# Altium project IoT-Speaker-v1.3.PrjPcb (part 2 of 2)

## Sheet Power-Sheet-2.SchDoc
size A4; DocumentNumber: 3; SheetNumber: 3; SheetTotal: 5
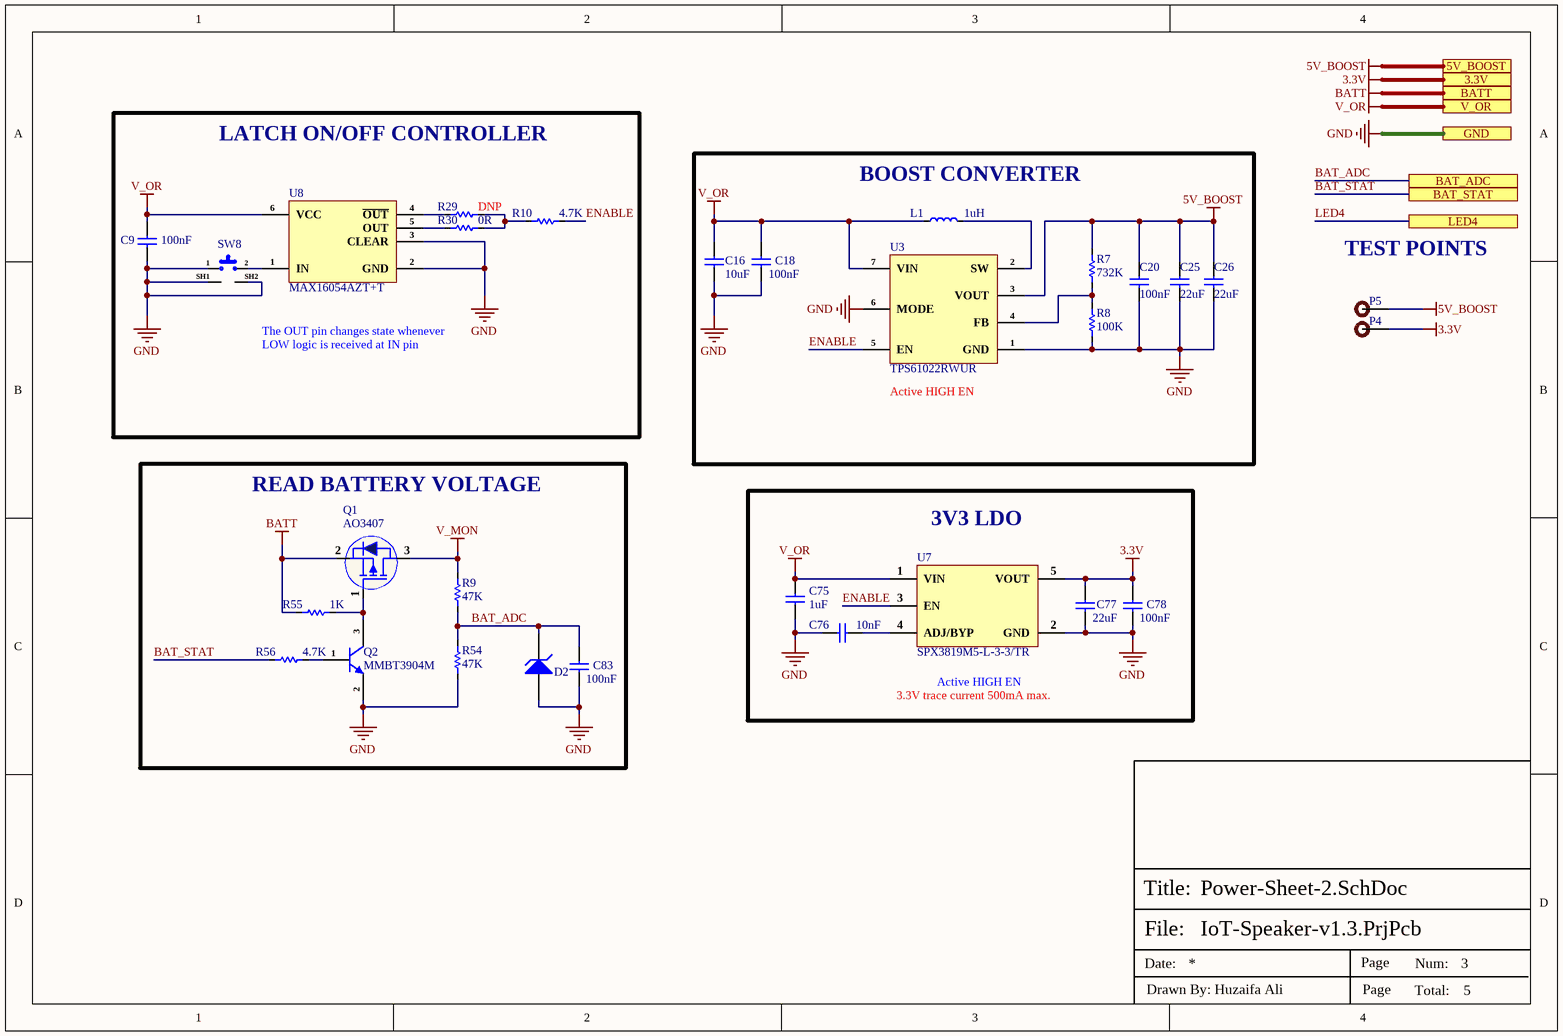
[diagram p1: Power-Sheet-2.SchDoc]

### Parts
C9  100nF  [Cap-0402]
C16  10uF  [Cap-0805]
C18  100nF  [Cap-0402]
C20  100nF  [Cap-0402]
C25  22uF  [Cap-0603]
C26  22uF  [Cap-0603]
C75  1uF  [Cap-0603]
C76  10nF  [Cap-0603]
C77  22uF  [Cap-0603]
C78  100nF  [Cap-0402]
C83  100nF  [Cap-0402]
D2  MM3Z3V3B  [SOD323F]  (value not drawn)
L1  1uH  [MPIT6045-1R0N-LF]
P4  TEST POINT  [Test-point]  (value not drawn)
P5  TEST POINT  [Test-point]  (value not drawn)
Q1  AO3407  [SOT-23]
Q2  MMBT3904M  [SOT-723]
R7  732K  [Res-0402]
R8  100K  [Res-0603]
R9  47K  [Res-0603]
R10  4.7K  [Res-0603]
R29  DNP  [Res-0603]  (no BOM)
R30  0R  [Res-0603]
R54  47K  [Res-0603]
R55  1K  [Res-0603]
R56  4.7K  [Res-0603]
SW8  TS-1087E-B3D2  [TS-1087E-B3D2]  (value not drawn)
U3  TPS61022RWUR  [7-VQFN-HR (2x2)]
U7  SPX3819M5-L-3-3/TR  [SOT-23-5]
U8  MAX16054AZT+T  [TSOT-23-6]

### Blocks framed on the sheet
LATCH ON/OFF CONTROLLER: C9 R10 R29 R30 SW8 U8
BOOST CONVERTER: C16 C18 C20 C25 C26 L1 R7 R8 U3
READ BATTERY VOLTAGE: C83 D2 Q1 Q2 R9 R54-R56
3V3 LDO: C75-C78 U7

### Ports
3.3V, 5V_BOOST, BAT_ADC, BAT_STAT, BATT, GND, LED4, V_OR

### Nets
3.3V: C77.2 C78.2 P4.1 U7.5(VOUT) ; port 3.3V
5V_BOOST: C20.2 C25.2 C26.2 P5.1 R7.2 U3.3(VOUT) ; port 5V_BOOST
BATT: Q1.2(S) R55.1 ; port BATT
GND: C9.1 C16.1 C18.1 C20.1 C25.1 C26.1 C75.1 C76.1 C77.1 C78.1 C83.1 D2.1(A) Q2.2(E) R8.1 R54.1 SW8.1 SW8.SH1 SW8.SH2 U3.1(GND) U3.6(MODE) U7.2(GND) U8.2(GND) U8.3(CLEAR) ; port GND
V_MON: Q1.3(D) R9.2
V_OR: C9.2 C16.2 C18.2 C75.2 L1.1 U3.7(VIN) U7.1(VIN) U8.6(VCC) ; port V_OR
BAT_ADC: C83.2 D2.2(K) R9.1 R54.2 ; port BAT_ADC
BAT_STAT: R56.1 ; port BAT_STAT
ENABLE: R10.2 U3.5(EN) U7.3(EN)
LED4: port LED4
NetC76_2: C76.2 U7.4(ADJ/BYP)
NetL1_2: L1.2 U3.2(SW)
NetQ1_1: Q1.1(G) Q2.3(C) R55.2
NetQ2_1: Q2.1(B) R56.2
NetR7_1: R7.1 R8.2 U3.4(FB)
NetR10_1: R10.1 R29.2 R30.2
NetR29_1: R29.1 U8.4(~{OUT})
NetR30_1: R30.1 U8.5(OUT)
NetSW8_2: SW8.2 U8.1(IN)

### Notes on the sheet
- TEST POINTS
- The OUT pin changes state whenever LOW logic is received at IN pin
- (near U3) Active HIGH EN
- 3.3V trace current 500mA max.
- (near U7) Active HIGH EN
- File:
- Title:
- Date:
- Page
- Num:
- Total:
- Drawn By: Huzaifa Ali

### Library data of the parts
C9 C18 C20 C78 C83 = CC0402KRX5R8BB104: CAP CER 0.1UF 25V X5R 0402; Manufacturer: Yageo; Tolerance: 10%; Item Type: Capacitor; Supplier 1: Digi-Key; Manufacturer Part Number: CC0402KRX5R8BB104; RoHS: Yes; Category: Ceramic Capacitors; Stock 1: 4598218; Pricing 1: 1=0.10000, 10=0.03800, 50=0.02100, 100=0.01710, 500=0.01224, 1000=0.00961, 2500=0.00874, 5000=0.00804 (USD); Mount: Surface Mount; Case/Package: 0402; Case Code (Metric): 1005; Case Code (Imperial): 0402; Min Operating Temperature: -55°C; Max Operating Temperature: 85°C; Voltage Rating: 25V; Packaging: Tape and Reel; Capacitance: 100nF; Voltage Rating (DC): 25V; Dielectric: X5R; Resistor Type: Ceramic; Series: CC; Length: 0.039inch; Width: 0.02inch; Thickness: 0.022inch; Depth: 0.5mm; Lead Free: Lead Free; Halogen Free: Halogen Free; RoHS Compliant: Yes; ComponentLink1URL: http://www.mouser.com/ds/2/447/UPY-GPHC_X5R_4V-to-50V_25-1131599.pdf?src-supplier=Mouser; ComponentLink1Description: http://www.mouser.com/ds/2/447/UPY-GPHC_X5R_4V-to-50V_25-1131599.pdf?src-supplier=Mouser; ComponentLink2URL: http://www.yageo.com/documents/recent/UPY-GPHC_X5R_4V-to-50V-16.pdf?src-supplier=Future+Electronics; ComponentLink2Description: http://www.yageo.com/documents/recent/UPY-GPHC_X5R_4V-to-50V-16.pdf?src-supplier=Future+Electronics; ComponentLink3URL: http://www.yageo.com/documents/recent/UPY-GPHC_X5R_4V-to-50V_25.pdf?src-supplier=Digi-Key; ComponentLink3Description: http://www.yageo.com/documents/recent/UPY-GPHC_X5R_4V-to-50V_25.pdf?src-supplier=Digi-Key; Supplier Part Number 1: 311-1697-1-ND; LCSC Part Number: C106256
C16 = CC0805KKX5R8BB106: CAP CER 10UF 25V X5R 0805; Manufacturer: Yageo; Tolerance: 10%; Item Type: Capacitor; Supplier 1: Digi-Key; Manufacturer Part Number: CC0805KKX5R8BB106; RoHS: Yes; Category: Ceramic Capacitors; Stock 1: 554290; Pricing 1: 1=0.31000, 10=0.21200, 50=0.14820, 100=0.12710, 500=0.09534, 1000=0.08050 (USD); Mount: Surface Mount; Case/Package: 0805; Case Code (Imperial): 0805; Case Code (Metric): 2012; Weight: 0.000194oz; Min Operating Temperature: -55°C; Max Operating Temperature: 85°C; Capacitance: 10uF; Voltage Rating (DC): 25V; Packaging: Tape and Reel; Voltage Rating: 25V; Dielectric: X5R; Termination: SMD/SMT; Resistor Type: Ceramic; Series: CC; Length: 0.079inch; Width: 0.049inch; Thickness: 0.057inch; Depth: 1.25mm; Lead Free: Lead Free; Halogen Free: Halogen Free; RoHS Compliant: Yes; ComponentLink1URL: http://www.mouser.com/ds/2/447/UPY-GPHC_X5R_4V-to-50V_25-1131599.pdf?src-supplier=Mouser; ComponentLink1Description: http://www.mouser.com/ds/2/447/UPY-GPHC_X5R_4V-to-50V_25-1131599.pdf?src-supplier=Mouser; ComponentLink2URL: http://www.yageo.com/documents/recent/UPY-GPHC_X5R_4V-to-50V_25.pdf?src-supplier=Digi-Key; ComponentLink2Description: http://www.yageo.com/documents/recent/UPY-GPHC_X5R_4V-to-50V_25.pdf?src-supplier=Digi-Key; Supplier Part Number 1: 311-1869-1-ND; LCSC Part Number: C89831
C25 C26 = CC0603MRX5R6BB226: CAP CER 22UF 10V X5R 0603; Manufacturer: Yageo; Tolerance: 20%; Item Type: Capacitor; Supplier 1: Digi-Key; Manufacturer Part Number: CC0603MRX5R6BB226; RoHS: Yes; Category: Ceramic Capacitors; Stock 1: 19628; Pricing 1: 1=0.68000, 10=0.48000, 50=0.36300, 100=0.31610, 500=0.23416, 1000=0.19903 (USD); Mount: Surface Mount; Case/Package: 0603; Case Code (Metric): 1608; Case Code (Imperial): 0603; Weight: 7.1E-05oz; Min Operating Temperature: -55°C; Max Operating Temperature: 85°C; Packaging: Tape and Reel; Capacitance: 22uF; Voltage Rating: 10V; Dielectric: X5R; Termination: SMD/SMT; Voltage Rating (DC): 10V; Package Quantity: 4000; Length: 0.063inch; Width: 0.8mm; Height: 0.8mm; Thickness: 0.035inch; Lead Free: Lead Free; Halogen Free: Halogen Free; RoHS Compliant: Yes; ComponentLink1URL: http://www.mouser.com/ds/2/447/Yageo_UPY-GP_NP0_16V-to-50V_9-358835.pdf?src-supplier=Mouser; ComponentLink1Description: http://www.mouser.com/ds/2/447/Yageo_UPY-GP_NP0_16V-to-50V_9-358835.pdf?src-supplier=Mouser; ComponentLink2URL: http://www.yageo.com/documents/recent/UPY-GPHC_X5R_4V-to-50V_25.pdf?src-supplier=Digi-Key; ComponentLink2Description: http://www.yageo.com/documents/recent/UPY-GPHC_X5R_4V-to-50V_25.pdf?src-supplier=Digi-Key; Supplier Part Number 1: 311-1819-1-ND; LCSC Part Number: C109447
C75 = CC0603KRX5R8BB105: CAP CER 1UF 25V X5R 0603; Manufacturer: Yageo; Tolerance: 10%; Item Type: Capacitor; Supplier 1: Digi-Key; Manufacturer Part Number: CC0603KRX5R8BB105; RoHS: Yes; Category: Ceramic Capacitors; Stock 1: 919939; Pricing 1: 1=0.12000, 10=0.08400, 50=0.04760, 100=0.03940, 500=0.02764, 1000=0.02288 (USD); Mount: Surface Mount; Case/Package: 0603; Number of Pins: 2; Case Code (Metric): 1608; Case Code (Imperial): 0603; Min Operating Temperature: -55°C; Max Operating Temperature: 85°C; Capacitance: 1uF; Dielectric: X5R; Package Quantity: 1; Voltage Rating: 25V; Packaging: Tape and Reel; Termination: SMD/SMT; Voltage Rating (DC): 25V; Series: CC; Construction: Flat; Length: 1.6mm; Width: 0.031inch; Height: 0.8mm; Thickness: 0.035inch; Depth: 0.8mm; Radiation Hardening: No; REACH SVHC: No SVHC; Lead Free: Lead Free; Halogen Free: Halogen Free; RoHS Compliant: Yes; ComponentLink1URL: https://datasheet.ciiva.com/176/mlccorderingcode-176785.pdf?src-supplier=Digi-Key; ComponentLink1Description: https://datasheet.ciiva.com/176/mlccorderingcode-176785.pdf?src-supplier=Digi-Key; ComponentLink2URL: https://datasheet.ciiva.com/176/mlccorderingcode-176786.pdf?src-supplier=Digi-Key; ComponentLink2Description: https://datasheet.ciiva.com/176/mlccorderingcode-176786.pdf?src-supplier=Digi-Key; ComponentLink3URL: https://datasheet.ciiva.com/176/mlccorderingcode-176787.pdf?src-supplier=Digi-Key; ComponentLink3Description: https://datasheet.ciiva.com/176/mlccorderingcode-176787.pdf?src-supplier=Digi-Key; ComponentLink4URL: https://datasheet.ciiva.com/17436/upy-gphc-x5r-4v-to-50v-12-17436952.pdf?src-supplier=Avnet+Europe; ComponentLink4Description: https://datasheet.ciiva.com/17436/upy-gphc-x5r-4v-to-50v-12-17436952.pdf?src-supplier=Avnet+Europe; ComponentLink5URL: https://datasheet.ciiva.com/7978/1525783-7978171.pdf?src-supplier=Element14; ComponentLink5Description: https://datasheet.ciiva.com/7978/1525783-7978171.pdf?src-supplier=Element14; ComponentLink6URL: https://datasheet.ciiva.com/11586/upy-gphc-x5r-4v-to-50v-12-11586318.pdf?src-supplier=Avnet; ComponentLink6Description: https://datasheet.ciiva.com/11586/upy-gphc-x5r-4v-to-50v-12-11586318.pdf?src-supplier=Avnet; Supplier Part Number 1: 311-1445-1-ND; LCSC Part Number: C14664
C76 = CC0603JRNPO9BN103: CAP CER 10000PF 50V C0G/NPO 0603; Manufacturer: Yageo; Tolerance: 5%; Item Type: Capacitor; Supplier 1: Arrow Electronics; Manufacturer Part Number: CC0603JRNPO9BN103; RoHS: Yes; Category: Ceramic Capacitors; Stock 1: 5425; Pricing 1: 1=0.42340, 10=0.29770, 25=0.25590, 100=0.19550, 250=0.19360, 500=0.14320, 1000=0.12060, 3000=0.11930 (USD); Mount: Surface Mount; Case/Package: 0603; Min Operating Temperature: -55°C; Max Operating Temperature: 125°C; Packaging: Tape and Reel; Capacitance: 10nF; Voltage Rating: 50V; Length: 0.063inch; Width: 0.031inch; Thickness: 0.035inch; RoHS Compliant: Yes; ComponentLink1URL: http://www.yageo.com/documents/recent/UPY-GP_NP0_16V-to-50V_16.pdf?src-supplier=Digi-Key; ComponentLink1Description: http://www.yageo.com/documents/recent/UPY-GP_NP0_16V-to-50V_16.pdf?src-supplier=Digi-Key; ComponentLink2URL: http://www.yageo.com/exep/pages/download/literatures/ProductSelectionGuide%202014_Final_2.pdf?src-supplier=Digi-Key; ComponentLink2Description: http://www.yageo.com/exep/pages/download/literatures/ProductSelectionGuide%202014_Final_2.pdf?src-supplier=Digi-Key; Supplier Part Number 1: CC0603JRNPO9BN103; LCSC Part Number: C389113
C77 = CC0603MRX5R6BB226: CAP CER 22UF 10V X5R 0603; Manufacturer: Yageo; Tolerance: 20%; Supplier 1: Digi-Key; Manufacturer Part Number: CC0603MRX5R6BB226; RoHS: Yes; Category: Ceramic Capacitors; Stock 1: 19628; Pricing 1: 1=0.68000, 10=0.48000, 50=0.36300, 100=0.31610, 500=0.23416, 1000=0.19903 (USD); Mount: Surface Mount; Case/Package: 0603; Case Code (Metric): 1608; Case Code (Imperial): 0603; Weight: 7.1E-05oz; Min Operating Temperature: -55°C; Max Operating Temperature: 85°C; Packaging: Tape and Reel; Capacitance: 22uF; Voltage Rating: 10V; Dielectric: X5R; Termination: SMD/SMT; Voltage Rating (DC): 10V; Package Quantity: 4000; Length: 0.063inch; Width: 0.8mm; Height: 0.8mm; Thickness: 0.035inch; Lead Free: Lead Free; Halogen Free: Halogen Free; RoHS Compliant: Yes; ComponentLink1URL: http://www.mouser.com/ds/2/447/Yageo_UPY-GP_NP0_16V-to-50V_9-358835.pdf?src-supplier=Mouser; ComponentLink1Description: http://www.mouser.com/ds/2/447/Yageo_UPY-GP_NP0_16V-to-50V_9-358835.pdf?src-supplier=Mouser; ComponentLink2URL: http://www.yageo.com/documents/recent/UPY-GPHC_X5R_4V-to-50V_25.pdf?src-supplier=Digi-Key; ComponentLink2Description: http://www.yageo.com/documents/recent/UPY-GPHC_X5R_4V-to-50V_25.pdf?src-supplier=Digi-Key; Supplier Part Number 1: 311-1819-1-ND; LCSC Part Number: C109447
D2 = MM3Z3V3B: DIODE ZENER 3.3V 200MW SOD323F; Manufacturer: ON Semiconductor / Fairchild; Forward Voltage: 1V; Tolerance: 2%; Impedance: 89R; Max Reverse Leakage Current: 4.5uA; Test Current: 5mA; Element Configuration: Single; Supplier 1: Digi-Key; Manufacturer Part Number: MM3Z3V3B; Stock 1: 473644; Pricing 1: 1=0.22, 10=0.18, 100=0.0956, 500=0.06288, 1000=0.04276 (USD); Mount: Surface Mount; Number of Pins: 2; Weight: 0.0276g; Min Operating Temperature: -65°C; Max Operating Temperature: 150°C; Packaging: Tape and Reel; Package Quantity: 1; Max Power Dissipation: 200mW; Zener Voltage: 3.3V; Voltage Tolerance: 2%; Power Dissipation: 200mW; Working Voltage: 3.3V; Peak Reverse Current: 4.5uA; Length: 1.3mm; Height: 1mm; Width: 1.7mm; Radiation Hardening: No; REACH SVHC: No SVHC; Lead Free: Lead Free; ComponentLink1URL: http://www.onsemi.com/pub/Collateral/MM3Z9V1B-D.pdf?src-supplier=Digi-Key; ComponentLink1Description: http://www.onsemi.com/pub/Collateral/MM3Z9V1B-D.pdf?src-supplier=Digi-Key; ComponentLink2URL: http://www.mouser.com/ds/2/149/MM3Z3V3B-187166.pdf?src-supplier=Mouser; ComponentLink2Description: http://www.mouser.com/ds/2/149/MM3Z3V3B-187166.pdf?src-supplier=Mouser; ComponentLink3URL: https://www.fairchildsemi.com/datasheets/MM/MM3Z9V1B.pdf?src-supplier=Avnet; ComponentLink3Description: https://www.fairchildsemi.com/datasheets/MM/MM3Z9V1B.pdf?src-supplier=Avnet; ComponentLink4URL: http://www.farnell.com/datasheets/1706525.pdf?src-supplier=Element14; ComponentLink4Description: http://www.farnell.com/datasheets/1706525.pdf?src-supplier=Element14; Supplier Part Number 1: MM3Z3V3BCT-ND; LCSC Part Number: C2978865
L1 = MPIT6045-1R0N-LF: 5.15A 1uH ±30% SMD Power Inductors ROHS; Manufacturer: microgate; Manufacturer Part Number: MPIT6045-1R0N-LF; Package: SMD; LCSC Part Number: C486570; Item Type: INductor; ComponentLink1Description: LCSC; ComponentLink1URL: https://www.lcsc.com/product-detail/Power-Inductors_microgate-MPIT6045-1R0N-LF_C486570.html
P4 P5 = TEST POINT: Test Point ON; Item Type: TEST POINT
Q1 = AO3407: 30V 4.1A 60mΩ@10V,4.1A 350mW 3V@250uA P Channel SOT-23 MOSFETs ROHS; Manufacturer: Guangdong Hottech; Item Type: Mosfet; Manufacturer Part Number: AO3407; Package: SOT-23; LCSC Part Number: C181093; ComponentLink1Description: LCSC; ComponentLink1URL: https://www.lcsc.com/product-detail/MOSFETs_Guangdong-Hottech-AO3407_C181093.html
Q2 = MMBT3904M: 40V 100mW 100@10mA,1V 200mA 300MHz 300mV@50mA,5mA NPN -55℃~+150℃@(Tj) SOT-723 Bipolar Transistors - BJT ROHS; Manufacturer: TECH PUBLIC; Item Type: Mosfet; ComponentLink1Description: LCSC; ComponentLink1URL: https://www.lcsc.com/product-detail/Bipolar-Transistors-BJT_TECH-PUBLIC-MMBT3904M_C2923360.html; Manufacturer Part Number: MMBT3904M; Package: SOT-723; LCSC Part Number: C2923360
R7 = FRC0402F7323TS: ±1% 732kΩ 0402 Chip Resistor - Surface Mount ROHS; Manufacturer: FOJAN; Manufacturer Part Number: FRC0402F7323TS; Package: 0402; LCSC Part Number: C5159692; Item Type: Resistor; ComponentLink1Description: LCSC; ComponentLink1URL: https://www.lcsc.com/product-detail/Chip-span-style-background-color-ff0-Resistor-span-Surface-Mount_FOJAN-FRC0402F7323TS_C5159692.html
R8 = RT0603BRD07100KL: RES SMD 100K OHM 0.1% 1/10W 0603; Manufacturer: Yageo; Resistance: 100kR; Temperature Coefficient: 25ppm/°C; Voltage Rating (DC): 75V; Power Rating: 100mW; Item Type: Resistor; Supplier 1: Digi-Key; Manufacturer Part Number: RT0603BRD07100KL; Stock 1: 53395; Pricing 1: 1=0.39, 10=0.332, 100=0.1298, 1000=0.05435, 2500=0.04982 (USD); Mount: Surface Mount; Case/Package: 0603; Case Code (Imperial): 0603; Case Code (Metric): 1608; Min Operating Temperature: -55°C; Max Operating Temperature: 125°C; Tolerance: 0.1%; Composition: Thin Film; Packaging: Tape and Reel; Voltage Rating: 75V; Package Quantity: 5000; Termination: SMD/SMT; Number of Terminations: 2; Military Standard: Not; Max Power Dissipation: 100mW; Working Voltage: 75V; Features: Moisture Resistant; Length: 1.6mm; Height: 0.022inch; Width: 0.031inch; Depth: 0.8mm; Lead Free: Lead Free; ComponentLink1URL: http://documents.rs-components.com/techlib://itc_doclist_GB.htm?stockno=6174810&src-supplier=RSComponents; ComponentLink1Description: http://documents.rs-components.com/techlib://itc_doclist_GB.htm?stockno=6174810&src-supplier=RSComponents; Supplier Part Number 1: YAG1235CT-ND; LCSC Part Number: C122538
R9 R54 = RC0603JR-0747KL: RES 47K OHM 5% 1/10W 0603; Manufacturer: Yageo; Resistance: 47kR; Power Rating: 100mW; Voltage Rating (DC): 50V; Temperature Coefficient: 100ppm/°C; Resistance Tolerance: 1%; Supplier 1: Arrow; Manufacturer Part Number: RC0603JR-0747KL; Stock 1: 599135; Pricing 1: 5000=0.0025, 10000=0.0022, 25000=0.0019, 1=0.0011, 6000=0.001 (USD); Case/Package: 0603; Number of Pins: 2; Case Code (Imperial): 0603; Case Code (Metric): 1608; Min Operating Temperature: -55°C; Max Operating Temperature: 155°C; Packaging: Tape and Reel; Tolerance: 5%; Voltage Rating: 50V; Package Quantity: 5000; Termination: SMD/SMT; Military Standard: Not; Composition: Thick Film; Length: 1.6mm; Height: 0.45mm; Width: 0.8mm; Depth: 0.8mm; REACH SVHC: No SVHC; Lead Free: Lead Free; ComponentLink1URL: http://www.farnell.com/datasheets/443971.pdf; ComponentLink1Description: http://www.farnell.com/datasheets/443971.pdf; ComponentLink2URL: http://www.mouser.com/catalog/specsheets/RC0603.pdf; ComponentLink2Description: http://www.mouser.com/catalog/specsheets/RC0603.pdf; Supplier Part Number 1: RC0603JR-0747KL; Supplier 2: Digi-Key; RoHS: Yes; Category: Chip SMD Resistors; Stock 2: 1087850; Pricing 2: 1=0.10000, 10=0.02300, 100=0.00930, 1000=0.00417, 2500=0.00362 (USD); Size Code: 0603; Number of Terminations: 2; Resistor Type: Thick Film; Features: Moisture Resistant; Series: RC; Max Power Dissipation: 100mW; Construction: Rectangular; RoHS Compliant: Yes; ComponentLink3URL: https://datasheet.ciiva.com/46395/443971-46395003.pdf?src-supplier=Element14; ComponentLink3Description: https://datasheet.ciiva.com/46395/443971-46395003.pdf?src-supplier=Element14; ComponentLink4URL: https://datasheet.ciiva.com/12558/rc0603-272842-12558744.pdf?src-supplier=Mouser; ComponentLink4Description: https://datasheet.ciiva.com/12558/rc0603-272842-12558744.pdf?src-supplier=Mouser; Supplier Part Number 2: 311-30.0KHRCT-ND; LCSC Part Number: C127447
R10 R56 = RC0603JR-074K7L: RES SMD 4.7K OHM 5% 1/10W 0603; Manufacturer: Yageo; Resistance: 4.7kR; Temperature Coefficient: 100ppm/°C; Voltage Rating (DC): 50V; Power Rating: 100mW; Item Type: Resistor; Supplier 1: Digi-Key; Manufacturer Part Number: RC0603JR-074K7L; Stock 1: 19706643; Pricing 1: 1=0.1, 10=0.02, 100=0.0081, 1000=0.00362, 2500=0.00314 (USD); Case/Package: 0603; Number of Pins: 2; Case Code (Imperial): 0603; Case Code (Metric): 1608; Min Operating Temperature: -55°C; Max Operating Temperature: 155°C; Tolerance: 5%; Composition: Thick Film; Packaging: Tape and Reel; Voltage Rating: 50V; Termination: SMD/SMT; Military Standard: Not; Length: 1.6mm; Width: 0.8mm; Depth: 0.8mm; REACH SVHC: No SVHC; Lead Free: Lead Free; ComponentLink1URL: http://www.farnell.com/datasheets/443971.pdf?src-supplier=Element14; ComponentLink1Description: http://www.farnell.com/datasheets/443971.pdf?src-supplier=Element14; Supplier Part Number 1: 311-4.7KGRCT-ND; LCSC Part Number: C105428
R29 R30 = RC0603FR-070RL: RES SMD 0R, 1%, 0.1W, 0603; Manufacturer: Yageo; Item Type: Resistor; Manufacturer Part Number: RC0603FR-070RL; Package: 0603; LCSC Part Number: C100044; ComponentLink9Description: LCSC; ComponentLink9URL: https://www.lcsc.com/product-detail/Chip-Resistor-Surface-Mount_YAGEO-RC0603FR-070RL_C100044.html
R55 = RC0603FR-071KL: RES SMD 1K OHM 1% 1/10W 0603; Manufacturer: Yageo; Resistance: 1kR; Temperature Coefficient: 100ppm/°C; Power Rating: 100mW; Voltage Rating: 50V; Item type: Resistor; ComponentLink1URL: https://www.verical.com/server-webapp/html/getDatasheet?partID=409289&src-supplier=Verical; ComponentLink1Description: https://www.verical.com/server-webapp/html/getDatasheet?partID=409289&src-supplier=Verical; Supplier 1: Digi-Key; Manufacturer Part Number: RC0603FR-071KL; Stock 1: 21472395; Pricing 1: 1=0.1, 10=0.023, 100=0.0094, 1000=0.0042, 2500=0.0037 (USD); Case/Package: 0603; Contact Plating: Tin,Matte; Case Code (Imperial): 0603; Case Code (Metric): 1608; Min Operating Temperature: -55°C; Max Operating Temperature: 155°C; Tolerance: 1%; Composition: Thick Film; Packaging: Tape and Reel; Termination: SMD/SMT; Military Standard: Not; Length: 1.6mm; Height: 0.45mm; Depth: 0.8mm; Radiation Hardening: No; REACH SVHC: No SVHC; Lead Free: Lead Free; ComponentLink2URL: http://documents.rs-components.com/techlib://itc_doclist_GB.htm?stockno=5048928&src-supplier=RSComponents; ComponentLink2Description: http://documents.rs-components.com/techlib://itc_doclist_GB.htm?stockno=5048928&src-supplier=RSComponents; ComponentLink3URL: http://www.yageo.com/documents/recent/PYu-RC0603_51_RoHS_L_4.pdf?src-supplier=Avnet+Europe; ComponentLink3Description: http://www.yageo.com/documents/recent/PYu-RC0603_51_RoHS_L_4.pdf?src-supplier=Avnet+Europe; ComponentLink4URL: http://www.farnell.com/datasheets/2167052.pdf?src-supplier=Element14; ComponentLink4Description: http://www.farnell.com/datasheets/2167052.pdf?src-supplier=Element14; ComponentLink5URL: http://www.farnell.com/datasheets/1868787.pdf?src-supplier=Element14; ComponentLink5Description: http://www.farnell.com/datasheets/1868787.pdf?src-supplier=Element14; ComponentLink6URL: http://www.yageo.com/documents/recent/PYu-RC_Group_51_RoHS_L_2.pdf?src-supplier=Avnet; ComponentLink6Description: http://www.yageo.com/documents/recent/PYu-RC_Group_51_RoHS_L_2.pdf?src-supplier=Avnet; ComponentLink7URL: https://www.verical.com/server-webapp/html/getDatasheet?partID=404327&src-supplier=Verical; ComponentLink7Description: https://www.verical.com/server-webapp/html/getDatasheet?partID=404327&src-supplier=Verical; ComponentLink8URL: http://www.farnell.com/datasheets/443971.pdf?src-supplier=Element14; ComponentLink8Description: http://www.farnell.com/datasheets/443971.pdf?src-supplier=Element14; Supplier Part Number 1: 311-1.00KHRDKR-ND; LCSC Part Number: C22548
SW8 = TS-1087E-B3D2: Plugin-4P,7.7x3.5mm Tactile Switches ROHS; Manufacturer: Yuandi; Manufacturer Part Number: TS-1087E-B3D2; LCSC Part Number: C541963; Item Type: Tactile Switch
U3 = TPS61022RWUR: 8-A boost converter with 0.5-V ultra-low input voltage 7-VQFN-HR -40 to 125; Manufacturer: Texas Instruments; Item Type: IC; Supplier 1: Digi-Key; Manufacturer Part Number: TPS61022RWUR; RoHS: Yes; Category: Voltage Regulators - Switching; Pricing 1: 1=1.88000, 10=1.68800, 25=1.59280, 100=1.35690, 250=1.27412, 500=1.11486, 1000=0.92374 (USD); Supplier Part Number 1: 296-TPS61022RWURDKR-ND; ComponentLink1Description: LCSC; ComponentLink1URL: https://www.lcsc.com/product-detail/DC-DC-Converters_Texas-Instruments-TPS61022RWUR_C915088.html; LCSC Part Number: C915088
U7 = SPX3819M5-L-3-3/TR: SPX3819 Series 3.3 V 500 mA Fixed Output SMT LDO Regulator - SOT-23-5; Manufacturer: MaxLinear; Item Type: IC; Supplier 1: Newark; Manufacturer Part Number: SPX3819M5-L-3-3/TR; RoHS: Yes; Category: Voltage Regulators - Linear; RoHS Compliant: Yes; Supplier Part Number 1: 23R9703; LCSC Part Number: C9055; ComponentLink1Description: LCSC; ComponentLink1URL: https://www.lcsc.com/product-detail/Linear-Voltage-Regulators-LDO_MaxLinear-SPX3819M5-L-3-3-TR_C9055.html
U8 = MAX16054AZT+T: IC CNTRLR ON/OFF W/DEB TSOT23-6; Manufacturer: Maxim; Max Power Dissipation: 727W; Max Supply Voltage: 5.5V; Min Supply Voltage: 2.7V; Number of Voltages Monitored: 1; Undervoltage Threshold: 1.8V; Operating Supply Current: 7uA; Watchdog Timer: No; Output Type: PUSH-PULL; Supplier 1: Arrow Electronics; Manufacturer Part Number: MAX16054AZT+T; RoHS: Yes; Category: Interface ICs; Stock 1: 3; Pricing 1: 1=2.99700 (USD); Mounting Technology: Surface Mount; Case/Package: SOT-23-6; Pins: 6; Contact Plating: Tin,Matte; Min Operating Temperature: -40°C; Max Operating Temperature: 125°C; Packaging: Tape and Reel; Package Quantity: 1; Series: -; Length: 4mm; Width: 4mm; Height: 0.73mm; Radiation Hardening: No; RoHS Compliant: Yes; ComponentLink1URL: https://datasheet.ciiva.com/4901/max16054-83881-4901086.pdf?src-supplier=Mouser; ComponentLink1Description: https://datasheet.ciiva.com/4901/max16054-83881-4901086.pdf?src-supplier=Mouser; ComponentLink2URL: https://datasheet.ciiva.com/1784/max16054-1784560.pdf?src-supplier=Digi-Key; ComponentLink2Description: https://datasheet.ciiva.com/1784/max16054-1784560.pdf?src-supplier=Digi-Key; ComponentLink3URL: https://datasheet.ciiva.com/14247/max16054-14247770.pdf?src-supplier=Avnet; ComponentLink3Description: https://datasheet.ciiva.com/14247/max16054-14247770.pdf?src-supplier=Avnet; ComponentLink4URL: https://datasheet.ciiva.com/1784/max16054-1784561.pdf?src-supplier=Digi-Key; ComponentLink4Description: https://datasheet.ciiva.com/1784/max16054-1784561.pdf?src-supplier=Digi-Key; ComponentLink5URL: https://datasheet.ciiva.com/1784/max16054-1784562.pdf?src-supplier=Digi-Key; ComponentLink5Description: https://datasheet.ciiva.com/1784/max16054-1784562.pdf?src-supplier=Digi-Key; Supplier Part Number 1: MAX16054AZT+T; LCSC Part Number: C79401; Item Type: IC

## Sheet Controller-Sheet.SchDoc
size A4; DocumentNumber: 4; SheetNumber: 4; SheetTotal: 5
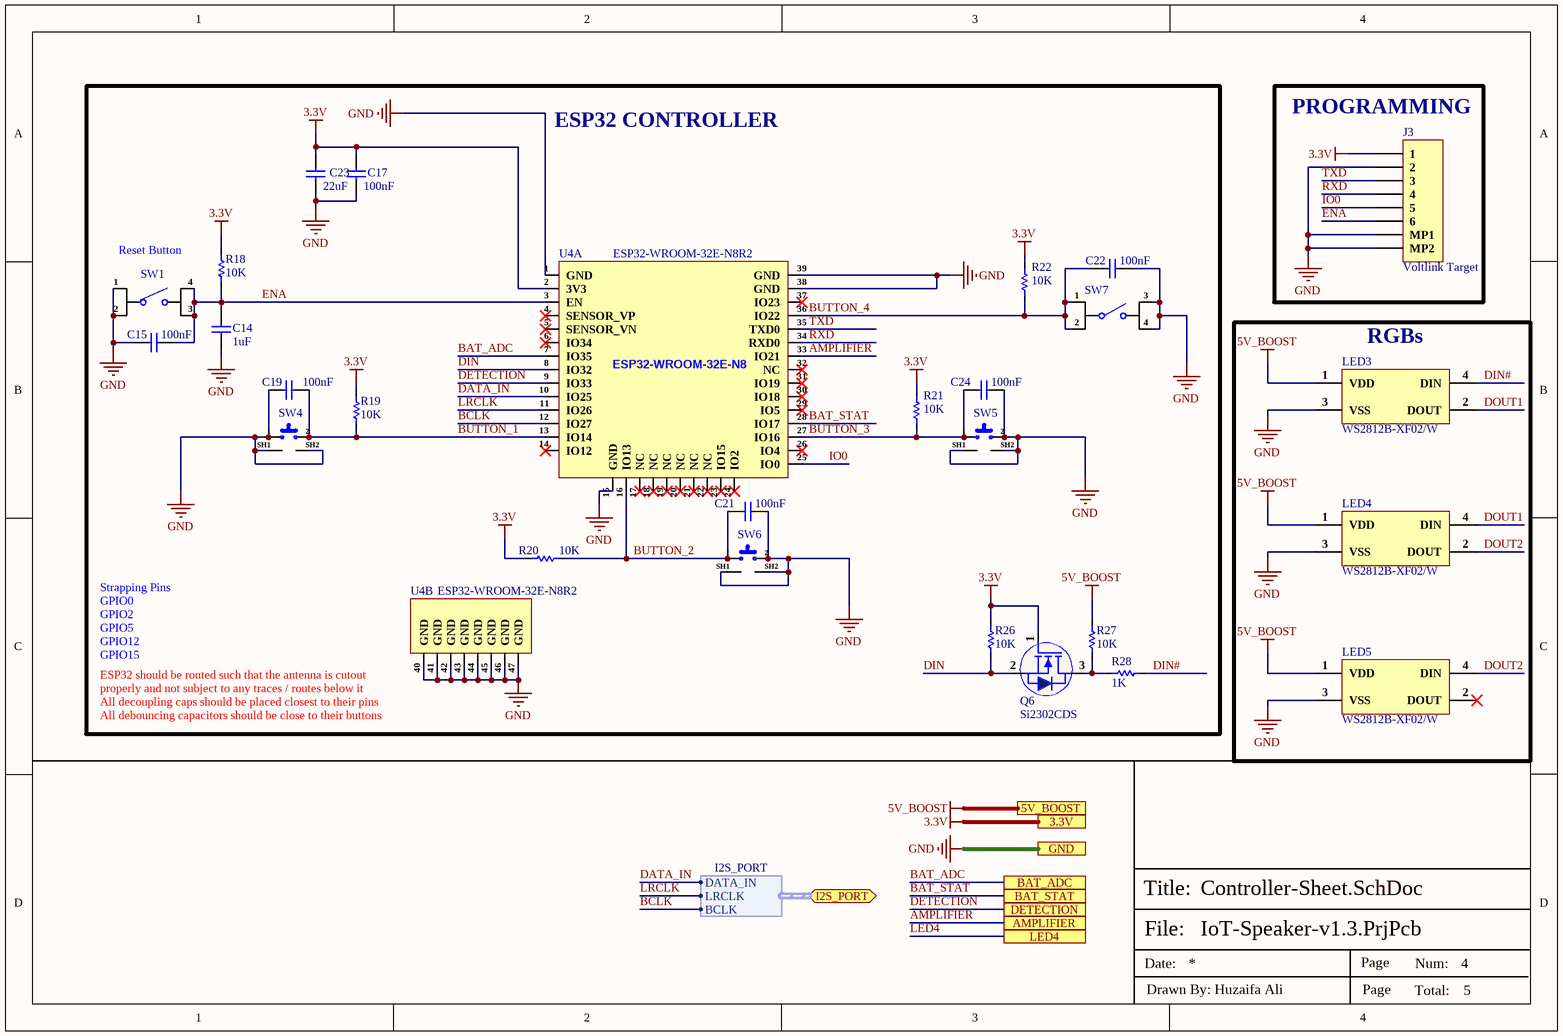
[diagram p2: Controller-Sheet.SchDoc]

### Parts
C14  1uF  [Cap-0603]
C15  100nF  [Cap-0402]
C17  100nF  [Cap-0402]
C19  100nF  [Cap-0402]
C21  100nF  [Cap-0402]
C22  100nF  [Cap-0402]
C23  22uF  [Cap-0603]
C24  100nF  [Cap-0402]
J3  Voltlink Target  [Voltlink Target]
LED3  WS2812B-XF02/W  [WS2812B-XF02/W]
LED4  WS2812B-XF02/W  [WS2812B-XF02/W]
LED5  WS2812B-XF02/W  [WS2812B-XF02/W]
Q6  Si2302CDS  [Sot-23]
R18  10K  [Res-0603]
R19  10K  [Res-0603]
R20  10K  [Res-0603]
R21  10K  [Res-0603]
R22  10K  [Res-0603]
R26  10K  [Res-0402]
R27  10K  [Res-0402]
R28  1K  [Res-0603]
SW1  TS-1109S-C-B  [TS-1109S-C-B]  (value not drawn)
SW4  TS-1087E-B3D2  [TS-1087E-B3D2]  (value not drawn)
SW5  TS-1087E-B3D2  [TS-1087E-B3D2]  (value not drawn)
SW6  TS-1087E-B3D2  [TS-1087E-B3D2]  (value not drawn)
SW7  TS-1109S-B-J  [TS-1109S-B-J_]  (value not drawn)
U4  ESP32-WROOM-32E-N8R2  [38-SMD Module]  (parts A,B of 2)

### Blocks framed on the sheet
ESP32 CONTROLLER: C14 C15 C17 C19 C21-C24 Q6 R18-R22 R26-R28 SW1 SW4-SW7 U4
PROGRAMMING: J3
RGBs: LED3-LED5

### Ports
3.3V, 5V_BOOST, AMPLIFIER, BAT_ADC, BAT_STAT, DETECTION, GND, I2S_PORT (bidir, harness I2S_PORT), LED4

### Harnesses
I2S_PORT: DATA_IN, LRCLK, BCLK

### Nets
3.3V: C17.2 C23.2 J3.1 Q6.1(G) R18.2 R19.2 R20.2 R21.2 R22.2 R26.1 U4.2(3V3) ; port 3.3V
5V_BOOST: LED3.1(VDD) LED4.1(VDD) LED5.1(VDD) R27.1 ; port 5V_BOOST
GND: C14.1 C15.1 C17.1 C19.2 C21.2 C22.2 C23.1 C24.2 J3.2 J3.MP1 J3.MP2 LED3.3(VSS) LED4.3(VSS) LED5.3(VSS) SW1.1 SW1.2 SW4.1 SW4.SH1 SW4.SH2 SW5.2 SW5.SH1 SW5.SH2 SW6.2 SW6.SH1 SW6.SH2 SW7.3 SW7.4 U4.1(GND) U4.15(GND) U4.38(GND) U4.39(GND) U4.40(GND) U4.41(GND) U4.42(GND) U4.43(GND) U4.44(GND) U4.45(GND) U4.46(GND) U4.47(GND) ; port GND
AMPLIFIER: U4.33(IO21) ; port AMPLIFIER
BAT_ADC: U4.7(IO35) ; port BAT_ADC
BAT_STAT: U4.28(IO17) ; port BAT_STAT
BCLK: U4.12(IO27) ; port I2S_PORT.BCLK
BUTTON_1: C19.1 R19.1 SW4.2 U4.13(IO14)
BUTTON_2: C21.1 R20.1 SW6.1 U4.16(IO13)
BUTTON_3: C24.1 R21.1 SW5.1 U4.27(IO16)
BUTTON_4: C22.1 R22.1 SW7.1 SW7.2 U4.36(IO22)
DATA_IN: U4.10(IO25) ; port I2S_PORT.DATA_IN
DETECTION: U4.9(IO33) ; port DETECTION
DIN: Q6.2(S) R26.2 U4.8(IO32)
DIN#: LED3.4(DIN) R28.2
DOUT1: LED3.2(DOUT) LED4.4(DIN)
DOUT2: LED4.2(DOUT) LED5.4(DIN)
ENA: C14.2 C15.2 J3.6 R18.1 SW1.3 SW1.4 U4.3(EN)
IO0: J3.5 U4.25(IO0)
LED4: port LED4
LRCLK: U4.11(IO26) ; port I2S_PORT.LRCLK
RXD: J3.4 U4.34(RXD0)
TXD: J3.3 U4.35(TXD0)
NetQ6_3: Q6.3(D) R27.2 R28.1

Not connected (* = marked no-connect by the designer): LED5 2(DOUT)*; U4 4(SENSOR_VP)* 5(SENSOR_VN)* 6(IO34)* 14(IO12)* 17(NC)* 18(NC)* 19(NC)* 20(NC)* 21(NC)* 22(NC)* 23(IO15)* 24(IO2)* 26(IO4)* 29(IO5)* 30(IO18)* 31(IO19)* 32(NC)* 37(IO23)*

### Notes on the sheet
- Reset Button
- Strapping Pins
  GPIO0
  GPIO2
  GPIO5
  GPIO12
  GPIO15
- ESP32 should be routed such that the antenna is cutout properly and not subject to any traces / routes below it
- All decoupling caps should be placed closest to their pins
- All debouncing capacitors should be close to their buttons
- File:
- Title:
- Date:
- Page
- Num:
- Total:
- Drawn By: Huzaifa Ali
- (in symbol ESP32-WROOM-32E-N8R2, part A) ESP32-WROOM-32E-N8

### Library data of the parts
C14 = CC0603KRX5R8BB105: CAP CER 1UF 25V X5R 0603; Manufacturer: Yageo; Tolerance: 10%; Supplier 1: Digi-Key; Manufacturer Part Number: CC0603KRX5R8BB105; RoHS: Yes; Category: Ceramic Capacitors; Stock 1: 919939; Pricing 1: 1=0.12000, 10=0.08400, 50=0.04760, 100=0.03940, 500=0.02764, 1000=0.02288 (USD); Mount: Surface Mount; Case/Package: 0603; Number of Pins: 2; Case Code (Metric): 1608; Case Code (Imperial): 0603; Min Operating Temperature: -55°C; Max Operating Temperature: 85°C; Capacitance: 1uF; Dielectric: X5R; Package Quantity: 1; Voltage Rating: 25V; Packaging: Tape and Reel; Termination: SMD/SMT; Voltage Rating (DC): 25V; Series: CC; Construction: Flat; Length: 1.6mm; Width: 0.031inch; Height: 0.8mm; Thickness: 0.035inch; Depth: 0.8mm; Radiation Hardening: No; REACH SVHC: No SVHC; Lead Free: Lead Free; Halogen Free: Halogen Free; RoHS Compliant: Yes; ComponentLink1URL: https://datasheet.ciiva.com/176/mlccorderingcode-176785.pdf?src-supplier=Digi-Key; ComponentLink1Description: https://datasheet.ciiva.com/176/mlccorderingcode-176785.pdf?src-supplier=Digi-Key; ComponentLink2URL: https://datasheet.ciiva.com/176/mlccorderingcode-176786.pdf?src-supplier=Digi-Key; ComponentLink2Description: https://datasheet.ciiva.com/176/mlccorderingcode-176786.pdf?src-supplier=Digi-Key; ComponentLink3URL: https://datasheet.ciiva.com/176/mlccorderingcode-176787.pdf?src-supplier=Digi-Key; ComponentLink3Description: https://datasheet.ciiva.com/176/mlccorderingcode-176787.pdf?src-supplier=Digi-Key; ComponentLink4URL: https://datasheet.ciiva.com/17436/upy-gphc-x5r-4v-to-50v-12-17436952.pdf?src-supplier=Avnet+Europe; ComponentLink4Description: https://datasheet.ciiva.com/17436/upy-gphc-x5r-4v-to-50v-12-17436952.pdf?src-supplier=Avnet+Europe; ComponentLink5URL: https://datasheet.ciiva.com/7978/1525783-7978171.pdf?src-supplier=Element14; ComponentLink5Description: https://datasheet.ciiva.com/7978/1525783-7978171.pdf?src-supplier=Element14; ComponentLink6URL: https://datasheet.ciiva.com/11586/upy-gphc-x5r-4v-to-50v-12-11586318.pdf?src-supplier=Avnet; ComponentLink6Description: https://datasheet.ciiva.com/11586/upy-gphc-x5r-4v-to-50v-12-11586318.pdf?src-supplier=Avnet; Supplier Part Number 1: 311-1445-1-ND; LCSC Part Number: C14664
C15 C17 C19 C21 C22 C24 = CC0402KRX5R8BB104: as C9 on sheet Power-Sheet-2; Supplier 1: Digi-Key; Manufacturer Part Number: CC0402KRX5R8BB104; RoHS: Yes; Category: Ceramic Capacitors; Stock 1: 4598218; Pricing 1: 1=0.10000, 10=0.03800, 50=0.02100, 100=0.01710, 500=0.01224, 1000=0.00961, 2500=0.00874, 5000=0.00804 (USD); Mount: Surface Mount; Case/Package: 0402; Case Code (Metric): 1005; Case Code (Imperial): 0402; Min Operating Temperature: -55°C; Max Operating Temperature: 85°C; Voltage Rating: 25V; Packaging: Tape and Reel; Capacitance: 100nF; Voltage Rating (DC): 25V; Dielectric: X5R; Resistor Type: Ceramic; Series: CC; Length: 0.039inch; Width: 0.02inch; Thickness: 0.022inch; Depth: 0.5mm; Lead Free: Lead Free; Halogen Free: Halogen Free; RoHS Compliant: Yes; ComponentLink1URL: http://www.mouser.com/ds/2/447/UPY-GPHC_X5R_4V-to-50V_25-1131599.pdf?src-supplier=Mouser; ComponentLink1Description: http://www.mouser.com/ds/2/447/UPY-GPHC_X5R_4V-to-50V_25-1131599.pdf?src-supplier=Mouser; ComponentLink2URL: http://www.yageo.com/documents/recent/UPY-GPHC_X5R_4V-to-50V-16.pdf?src-supplier=Future+Electronics; ComponentLink2Description: http://www.yageo.com/documents/recent/UPY-GPHC_X5R_4V-to-50V-16.pdf?src-supplier=Future+Electronics; ComponentLink3URL: http://www.yageo.com/documents/recent/UPY-GPHC_X5R_4V-to-50V_25.pdf?src-supplier=Digi-Key; ComponentLink3Description: http://www.yageo.com/documents/recent/UPY-GPHC_X5R_4V-to-50V_25.pdf?src-supplier=Digi-Key; Supplier Part Number 1: 311-1697-1-ND; LCSC Part Number: C106256
C23 = CC0603MRX5R6BB226: as C77 on sheet Power-Sheet-2; Supplier 1: Digi-Key; Manufacturer Part Number: CC0603MRX5R6BB226; RoHS: Yes; Category: Ceramic Capacitors; Stock 1: 19628; Pricing 1: 1=0.68000, 10=0.48000, 50=0.36300, 100=0.31610, 500=0.23416, 1000=0.19903 (USD); Mount: Surface Mount; Case/Package: 0603; Case Code (Metric): 1608; Case Code (Imperial): 0603; Weight: 7.1E-05oz; Min Operating Temperature: -55°C; Max Operating Temperature: 85°C; Packaging: Tape and Reel; Capacitance: 22uF; Voltage Rating: 10V; Dielectric: X5R; Termination: SMD/SMT; Voltage Rating (DC): 10V; Package Quantity: 4000; Length: 0.063inch; Width: 0.8mm; Height: 0.8mm; Thickness: 0.035inch; Lead Free: Lead Free; Halogen Free: Halogen Free; RoHS Compliant: Yes; ComponentLink1URL: http://www.mouser.com/ds/2/447/Yageo_UPY-GP_NP0_16V-to-50V_9-358835.pdf?src-supplier=Mouser; ComponentLink1Description: http://www.mouser.com/ds/2/447/Yageo_UPY-GP_NP0_16V-to-50V_9-358835.pdf?src-supplier=Mouser; ComponentLink2URL: http://www.yageo.com/documents/recent/UPY-GPHC_X5R_4V-to-50V_25.pdf?src-supplier=Digi-Key; ComponentLink2Description: http://www.yageo.com/documents/recent/UPY-GPHC_X5R_4V-to-50V_25.pdf?src-supplier=Digi-Key; Supplier Part Number 1: 311-1819-1-ND; LCSC Part Number: C109447
J3 = C145963: 1x6P SH 1 1mm 6 SMD,P=1mm Wire To Board / Wire To Wire Connector ROHS; Manufacturer: BOOMELE; Manufacturer Part Number: C145963; Package: SMD,P=1mm; LCSC Part Number: C145963; Item Type: Connector; ComponentLink1Description: LCSC; ComponentLink1URL: https://www.lcsc.com/product-detail/Wire-To-Board-Wire-To-Wire-Connector_BOOMELE-Boom-Precision-Elec-C145963_C145963.html
LED3-LED5 = WS2812B-XF02/W: SMD5050 Light Emitting Diodes (LED) ROHS; Manufacturer: Worldsemi; Item Type: RGB LED; Manufacturer Part Number: WS2812B-XF02/W; Package: SMD5050; LCSC Part Number: C4154882; ComponentLink1Description: LCSC; ComponentLink1URL: https://www.lcsc.com/product-detail/Light-Emitting-Diodes-LED_Worldsemi-WS2812B-XF02-W_C4154882.html
Q6 = Si2302CDS: N-CHANNEL 20-V (D-S) MOSFET; Manufacturer: TECH PUBLIC; ComponentLink1Description: LCSC; ComponentLink1URL: https://www.lcsc.com/product-detail/MOSFETs_TECH-PUBLIC-SI2302CDS_C5310968.html; Manufacturer Part Number: SI2302CDS; Package: SOT-23; LCSC Part Number: C5310968; Item Type: Mosfet
R18-R22 = RC0603FR-0710KL: RES SMD 10K Ohm 1% 1/10W 0603; Manufacturer: Yageo; Resistance: 10kR; Temperature Coefficient: 100ppm/°C; Voltage Rating (DC): 50V; Power Rating: 100mW; Voltage Rating: 75V; Item Type: Resistor; Supplier 1: Digi-Key; Manufacturer Part Number: RC0603FR-0710KL; RoHS: Yes; Category: Chip SMD Resistors; Stock 1: 25249139; Pricing 1: 1=0.10000, 10=0.02400, 100=0.00970, 1000=0.00436, 2500=0.00378 (USD); Case/Package: 0603; Number of Pins: 2; Case Code (Imperial): 0603; Case Code (Metric): 1608; Weight: 7.1E-05oz; Size Code: 0603; Min Operating Temperature: -55°C; Max Operating Temperature: 155°C; Tolerance: 1%; Resistor Type: Thick Film; Packaging: Tape and Reel; Termination: SMD/SMT; Features: Moisture Resistant; Series: RC; Max Power Dissipation: 100mW; Number of Terminations: 2; Resistance Tolerance: 1%; Construction: Rectangular; Length: 1.6mm; Width: 0.8mm; Height: 0.45mm; Depth: 0.8mm; Lead Pitch: 0.3mm; REACH SVHC: Unknown; Lead Free: Lead Free; Military Standard: Not; RoHS Compliant: Yes; ComponentLink1URL: https://datasheet.ciiva.com/7660/38590-7660789.pdf?src-supplier=Element14; ComponentLink1Description: https://datasheet.ciiva.com/7660/38590-7660789.pdf?src-supplier=Element14; ComponentLink2URL: https://datasheet.ciiva.com/7983/443971-7983596.pdf?src-supplier=Element14; ComponentLink2Description: https://datasheet.ciiva.com/7983/443971-7983596.pdf?src-supplier=Element14; ComponentLink3URL: https://datasheet.ciiva.com/22747/443971-22747519.pdf?src-supplier=Element14; ComponentLink3Description: https://datasheet.ciiva.com/22747/443971-22747519.pdf?src-supplier=Element14; ComponentLink4URL: https://datasheet.ciiva.com/46440/1868787-46440891.pdf?src-supplier=Element14; ComponentLink4Description: https://datasheet.ciiva.com/46440/1868787-46440891.pdf?src-supplier=Element14; ComponentLink5URL: https://datasheet.ciiva.com/7746/1738695-7746239.pdf?src-supplier=Element14; ComponentLink5Description: https://datasheet.ciiva.com/7746/1738695-7746239.pdf?src-supplier=Element14; ComponentLink6URL: https://datasheet.ciiva.com/15189/getdatasheetpartid-409289-15189591.pdf?src-supplier=Verical; ComponentLink6Description: https://datasheet.ciiva.com/15189/getdatasheetpartid-409289-15189591.pdf?src-supplier=Verical; Supplier Part Number 1: 311-10.0KHRCT-ND; LCSC Part Number: C98220
R26 R27 = RC0402FR-0710KL: RES 10K OHM 1% 1/16W 0402; Manufacturer: Yageo; Resistance: 10kR; Voltage Rating (DC): 50V; Temperature Coefficient: 100ppm/°C; Power Rating: 62.5mW; Max Power Dissipation: 63mW; Item Type: Resistor; Supplier 1: Mouser; Manufacturer Part Number: RC0402FR-0710KL; RoHS: Yes; Category: Chip SMD Resistors; Stock 1: 18648329; Pricing 1: 1=0.10000, 10=0.01400, 50=0.01400, 100=0.00500, 1000=0.00300, 10000=0.00200 (USD); Case/Package: 0402; Number of Pins: 2; Case Code (Imperial): 0402; Case Code (Metric): 1005; Min Operating Temperature: -55°C; Max Operating Temperature: 155°C; Resistor Type: Thick Film; Tolerance: 1%; Packaging: Tape and Reel; Voltage Rating: 50V; Termination: SMD/SMT; Working Voltage: 50V; Number of Terminations: 2; Features: Moisture Resistant; Series: RC; Resistance Tolerance: 1%; Construction: Rectangular; Length: 1mm; Width: 0.5mm; Height: 0.32mm; Depth: 0.5mm; Lead Pitch: 0.2mm; REACH SVHC: No SVHC; Lead Free: Lead Free; RoHS Compliant: Yes; Military Standard: Not; ComponentLink1URL: https://datasheet.ciiva.com/7660/38568-7660787.pdf?src-supplier=Element14; ComponentLink1Description: https://datasheet.ciiva.com/7660/38568-7660787.pdf?src-supplier=Element14; ComponentLink2URL: https://datasheet.ciiva.com/7849/1686128-7849814.pdf?src-supplier=Element14; ComponentLink2Description: https://datasheet.ciiva.com/7849/1686128-7849814.pdf?src-supplier=Element14; ComponentLink3URL: https://datasheet.ciiva.com/7983/1018594-7983486.pdf?src-supplier=Element14; ComponentLink3Description: https://datasheet.ciiva.com/7983/1018594-7983486.pdf?src-supplier=Element14; ComponentLink4URL: https://datasheet.ciiva.com/22747/1018594-22747512.pdf?src-supplier=Element14; ComponentLink4Description: https://datasheet.ciiva.com/22747/1018594-22747512.pdf?src-supplier=Element14; ComponentLink5URL: https://datasheet.ciiva.com/12667/pyu-rc0402-51-rohs-l-6-r-12667067.pdf?src-supplier=Mouser; ComponentLink5Description: https://datasheet.ciiva.com/12667/pyu-rc0402-51-rohs-l-6-r-12667067.pdf?src-supplier=Mouser; ComponentLink6URL: https://datasheet.ciiva.com/7849/1784430-7849813.pdf?src-supplier=Element14; ComponentLink6Description: https://datasheet.ciiva.com/7849/1784430-7849813.pdf?src-supplier=Element14; ComponentLink7URL: https://datasheet.ciiva.com/7849/1784430-7849815.pdf?src-supplier=Element14; ComponentLink7Description: https://datasheet.ciiva.com/7849/1784430-7849815.pdf?src-supplier=Element14; Supplier Part Number 1: 603-RC0402FR-0710KL; LCSC Part Number: C60490
R28 = RC0603FR-071KL: as R55 on sheet Power-Sheet-2; ComponentLink1URL: https://www.verical.com/server-webapp/html/getDatasheet?partID=409289&src-supplier=Verical; ComponentLink1Description: https://www.verical.com/server-webapp/html/getDatasheet?partID=409289&src-supplier=Verical; Supplier 1: Digi-Key; Manufacturer Part Number: RC0603FR-071KL; Stock 1: 21472395; Pricing 1: 1=0.1, 10=0.023, 100=0.0094, 1000=0.0042, 2500=0.0037 (USD); Case/Package: 0603; Contact Plating: Tin,Matte; Case Code (Imperial): 0603; Case Code (Metric): 1608; Min Operating Temperature: -55°C; Max Operating Temperature: 155°C; Tolerance: 1%; Composition: Thick Film; Packaging: Tape and Reel; Termination: SMD/SMT; Military Standard: Not; Length: 1.6mm; Height: 0.45mm; Depth: 0.8mm; Radiation Hardening: No; REACH SVHC: No SVHC; Lead Free: Lead Free; ComponentLink2URL: http://documents.rs-components.com/techlib://itc_doclist_GB.htm?stockno=5048928&src-supplier=RSComponents; ComponentLink2Description: http://documents.rs-components.com/techlib://itc_doclist_GB.htm?stockno=5048928&src-supplier=RSComponents; ComponentLink3URL: http://www.yageo.com/documents/recent/PYu-RC0603_51_RoHS_L_4.pdf?src-supplier=Avnet+Europe; ComponentLink3Description: http://www.yageo.com/documents/recent/PYu-RC0603_51_RoHS_L_4.pdf?src-supplier=Avnet+Europe; ComponentLink4URL: http://www.farnell.com/datasheets/2167052.pdf?src-supplier=Element14; ComponentLink4Description: http://www.farnell.com/datasheets/2167052.pdf?src-supplier=Element14; ComponentLink5URL: http://www.farnell.com/datasheets/1868787.pdf?src-supplier=Element14; ComponentLink5Description: http://www.farnell.com/datasheets/1868787.pdf?src-supplier=Element14; ComponentLink6URL: http://www.yageo.com/documents/recent/PYu-RC_Group_51_RoHS_L_2.pdf?src-supplier=Avnet; ComponentLink6Description: http://www.yageo.com/documents/recent/PYu-RC_Group_51_RoHS_L_2.pdf?src-supplier=Avnet; ComponentLink7URL: https://www.verical.com/server-webapp/html/getDatasheet?partID=404327&src-supplier=Verical; ComponentLink7Description: https://www.verical.com/server-webapp/html/getDatasheet?partID=404327&src-supplier=Verical; ComponentLink8URL: http://www.farnell.com/datasheets/443971.pdf?src-supplier=Element14; ComponentLink8Description: http://www.farnell.com/datasheets/443971.pdf?src-supplier=Element14; Supplier Part Number 1: 311-1.00KHRDKR-ND; LCSC Part Number: C22548
SW1 = TS-1109S-C-B: No NO 50mA 4.5mm 100000 260gf 12V -30℃~+85℃ 4.5mm 4.3mm Black Round Button Brick nogging SPST SMD Tactile Switches ROHS; Manufacturer: XKB Connectivity; Item Type: Switch; Manufacturer Part Number: TS-1109S-C-B; Package: Custom; LCSC Part Number: C381037; ComponentLink1Description: LCSC; ComponentLink1URL: https://www.lcsc.com/product-detail/Tactile-Switches_XKB-Connectivity-TS-1109S-C-B_C381037.html
SW4-SW6 = TS-1087E-B3D2: as SW8 on sheet Power-Sheet-2; Manufacturer Part Number: TS-1087E-B3D2; LCSC Part Number: C541963; Item Type: Tactile Switch
SW7 = TS-1109S-B-J: No NO 50mA 4.5mm 100000 160gf 12V -30℃~+85℃ 4.5mm 8mm Black Round Button Brick nogging SPST SMD Tactile Switches ROHS; Manufacturer: XKB Connectivity; Item Type: Switch; Manufacturer Part Number: TS-1109S-B-J; Package: SMD; LCSC Part Number: C480323; ComponentLink1Description: LCSC; ComponentLink1URL: https://www.lcsc.com/product-detail/span-style-background-color-ff0-Tactile-span-Switches_XKB-Connectivity-TS-1109S-B-J_C480323.html
U4 = ESP32-WROOM-32E-N8R2: RF TXRX MODULE BT PCB TRACE SMD; Manufacturer: Espressif Systems; Supplier: Digikey; Supplier Part Number: 1965-ESP32-WROOM-32E-N8R2DKR-ND; Manufacturer Part Number: ESP32-WROOM-32E-N8R2; RoHS: No; Category: Uncategorized; Pricing: 1=2.88 (USD); LCSC Part Number: C5361945; Item Type: Module